# EasyEDA Pro project MAX5864_REUSE.eprj, board PCB4
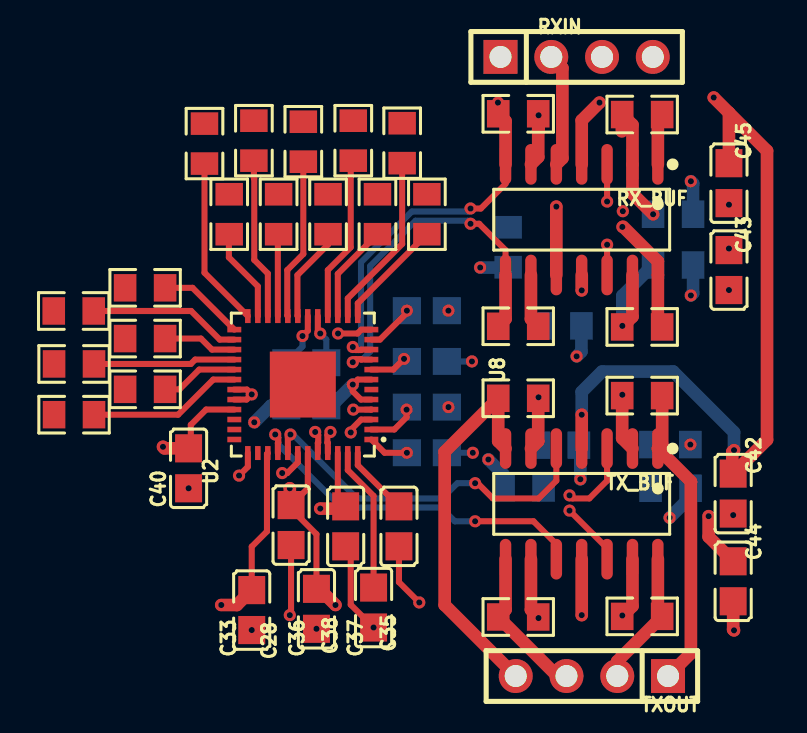
[diagram p10: board, top side]
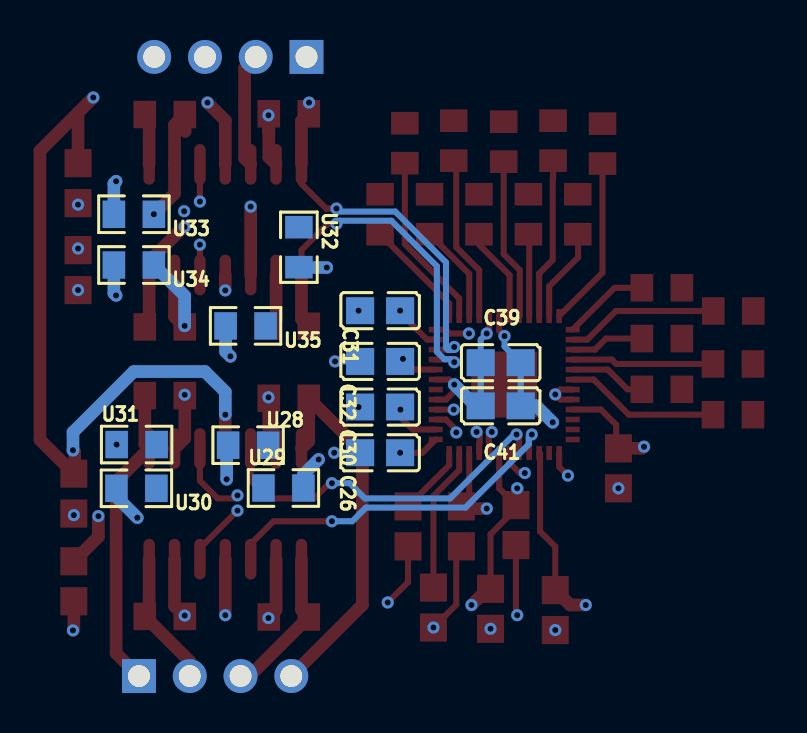
[diagram p11: board, bottom side, seen from below]

No outline. copper layers: Top Layer, GND, inner3, Inner, VCC, Bottom Layer. Coordinates in mm from the lowest, leftmost part position.
Stack: Top Layer 0.035mm 外层铜厚1oz / Dielectric1 0.0994mm 3313 RC57% 4.2mil / GND 0.035mm - / Dielectric2 0.55mm 0.55mm H/H不含铜 / inner3 0.035mm - / Dielectric3 0.1088mm 2116 RC54% 4.9mil / Inner 0.035mm - / Dielectric4 0.55mm 0.55mm H/H不含铜 / VCC 0.0152mm 内层铜厚 / Dielectric5 0.0994mm 3313 RC57% 4.2mil / Bottom Layer 0.035mm 外层铜厚1oz

## Design rules (mm)
net RX_BBCIP: RX_BBCI
net RX_BBCIN: RX_BBCI
net RX_BBCQN: RX_BBCQ
net RX_BBCQP: RX_BBCQ
net BBC_QN: BBC_Q
net BBC_QP: BBC_Q
net BBC_IN: BBC_I
net BBC_IP: BBC_I
template: JLCPCB Capability(Two Layers Board)
spacing copperThickness1oz (default): track to track 0.102, other pairs 0.152 to 0.3
spacing copperThickness2oz: track to track 0.203, other pairs 0.152 to 0.3
track width copperThickness1oz (default): min 0.127, default 0.254, max 2.54
track width copperThickness2oz: min 0.203, default 0.254, max 2.54
differential pair differentialPair (default): width min 0.127, default 0.254, max 2.54; gap min 0.152, default 0.152
via viaSize (default): diameter min 0.5, default 0.61, max 10; hole min 0.3, default 0.305, max 6.3

## Placement (name value [footprint] x y rotation side)
C26  330nF  [C0805]  17.67 11.18 180 bottom
C28  100nF  [C0805]  10.87 7.56 90 top
C30  100nF  [C0805]  17.67 13.46 0 bottom
C31  100nF  [C0805]  17.67 18.29 180 bottom
C32  100nF  [C0805]  17.67 15.75 180 bottom
C33  100nF  [C0805]  8.91 3.3 270 top
C35  330nF  [C0805]  16.27 7.49 270 top
C36  100nF  [C0805]  12.14 3.37 90 top
C37  330nF  [C0805]  15 3.43 90 top
C38  100nF  [C0805]  13.61 7.49 90 top
C39  100nF  [C0805]  11.64 15.68 180 bottom
C40  100nF  [C0805]  5.75 10.4 90 top
C41  100nF  [C0805]  11.64 13.53 180 bottom
C42  330nF  [C0805]  32.99 9.13 90 top
C43  330nF  [C0805]  32.78 20.32 270 top
C44  330nF  [C0805]  32.99 4.74 270 top
C45  330nF  [C0805]  32.78 24.67 90 top
RX_BUF  CLC4601ISO14X  [SOIC-14_L8.7-W3.9-P1.27-LS6.0-BL]  25.42 22.84 180 top
RXIN  -  [HDR-TH_4P-P2.54-V-F]  25.16 30.99 0 top
TX_BUF  CLC4601ISO14X  [SOIC-14_L8.7-W3.9-P1.27-LS6.0-BL]  25.42 8.62 180 top
TXOUT  -  [HDR-TH_4P-P2.54-V-F]  25.92 0 180 top
U2  MAX5864ETM+  [qfn-48_l7.0-w7.0-p0.50-bl-ep5.1]  11.46 14.59 90 top
U3  1120  [R0805]  22.24 2.96 0 top
U4  1120  [R0805]  28.44 28.1 0 top
U5  1120  [R0805]  28.44 17.47 180 top
U6  1120  [R0805]  22.24 17.51 0 top
U7  1120  [R0805]  22.24 28.14 180 top
U8  1120  [R0805]  22.24 13.9 180 top
U9  1120  [R0805]  28.44 14.04 0 top
U10  1120  [R0805]  28.44 2.99 180 top
U11  100  [R0805]  0.02 13.08 0 top
U12  100  [R0805]  3.57 14.35 0 top
U13  100  [R0805]  0.02 15.62 0 top
U14  100  [R0805]  3.57 16.89 0 top
U15  100  [R0805]  0 18.27 0 top
U16  100  [R0805]  3.57 19.43 0 top
U17  100  [R0805]  6.54 26.65 90 top
U18  100  [R0805]  7.78 23.11 90 top
U19  100  [R0805]  9.02 26.8 90 top
U20  100  [R0805]  10.25 23.11 90 top
U21  100  [R0805]  11.49 26.75 90 top
U22  100  [R0805]  12.72 23.11 90 top
U23  100  [R0805]  13.99 26.8 90 top
U24  100  [R0805]  15.2 23.11 90 top
U25  100  [R0805]  16.43 26.67 90 top
U26  100  [R0805]  17.67 23.11 90 top
U28  1120  [R0805]  24.27 11.56 0 bottom
U29  1120  [R0805]  22.51 9.41 180 bottom
U30  1120  [R0805]  29.86 9.4 0 bottom
U31  1120  [R0805]  29.85 11.59 180 bottom
U32  1120  [R0805]  21.73 21.46 270 bottom
U33  1120  [R0805]  29.99 23.11 0 bottom
U34  1120  [R0805]  29.99 20.57 0 bottom
U35  1120  [R0805]  24.4 17.53 0 bottom

## Footprints (pads in the part's own frame, mm; a bottom-side part is the same pattern mirrored in y, then rotated)
C0805
  rect 1.41x1.35 smd: 1(-1,0) 2(1,0)
HDR-TH_4P-P2.54-V-F
  rect 1.7x1.7 hole 1.1: 1(-3.81,0)
  round 1.7 hole 1.1: 2(-1.27,0) 3(1.27,0) 4(3.81,0)
qfn-48_l7.0-w7.0-p0.50-bl-ep5.1
  rect 0.28x0.7 smd: 1(-2.75,-3.428) 2(-2.25,-3.428) 3(-1.75,-3.428) 4(-1.25,-3.428) 5(-0.75,-3.428) 6(-0.25,-3.428) 7(0.25,-3.428) 8(0.75,-3.428) 9(1.25,-3.428) 10(1.75,-3.428) 11(2.25,-3.428) 12(2.75,-3.428) 25(2.75,3.428) 26(2.25,3.428) 27(1.75,3.428) 28(1.25,3.428) 29(0.75,3.428) 30(0.25,3.428) 31(-0.25,3.428) 32(-0.75,3.428) 33(-1.25,3.428) 34(-1.75,3.428) 35(-2.25,3.428) 36(-2.75,3.428)
  rect 0.7x0.28 smd: 13(3.428,-2.75) 14(3.428,-2.25) 15(3.428,-1.75) 16(3.428,-1.25) 17(3.428,-0.75) 18(3.428,-0.25) 19(3.428,0.25) 20(3.428,0.75) 21(3.428,1.25) 22(3.428,1.75) 23(3.428,2.25) 24(3.428,2.75) 37(-3.428,2.75) 38(-3.428,2.25) 39(-3.428,1.75) 40(-3.428,1.25) 41(-3.428,0.75) 42(-3.428,0.25) 43(-3.428,-0.25) 44(-3.428,-0.75) 45(-3.428,-1.25) 46(-3.428,-1.75) 47(-3.428,-2.25) 48(-3.428,-2.75)
  rect 3.302x3.302 smd: 49(0,0)
R0805
  rect 1.133x1.377 smd: 1(-1,0) 2(1,0)
SOIC-14_L8.7-W3.9-P1.27-LS6.0-BL
  oval 0.574x2.038 smd: 1(-3.81,-2.769) 2(-2.54,-2.769) 3(-1.27,-2.769) 4(0,-2.769) 5(1.27,-2.769) 6(2.54,-2.769) 7(3.81,-2.769) 8(3.81,2.769) 9(2.54,2.769) 10(1.27,2.769) 11(0,2.769) 12(-1.27,2.769) 13(-2.54,2.769) 14(-3.81,2.769)

## Nets
+5V: C42.2 C45.2 RX_BUF.4 TX_BUF.4
-5V: C43.2 C44.2 RX_BUF.11 TX_BUF.11
GND: C26.1 C28.1 C30.2 C31.1 C32.1 C33.2 C35.2 C36.1 C37.1 C38.1 C39.1 C40.1 C41.1 C42.1 C43.1 C44.1 C45.1 U2.5 U2.7 U2.12 U2.17 U2.31 U2.32 U2.37 U2.42 U28.2 U29.2 U30.2 U31.1 U32.2 U33.2 U34.2 U35.2
VCC: C28.2 C30.1 C31.2 C32.2 C33.1 C36.2 C38.2 C39.2 C40.2 C41.2 U2.2 U2.8 U2.11 U2.18 U2.33 U2.39 U2.43 U2.46
BBC_CLK: U2.6
BBC_DA0: U26.2
BBC_DA1: U25.2
BBC_DA2: U24.2
BBC_DA3: U23.2
BBC_DA4: U22.2
BBC_DA5: U21.2
BBC_DA6: U20.2
BBC_DA7: U19.2
BBC_DD0: U18.2
BBC_DD1: U17.2
BBC_DD2: U16.1
BBC_DD3: U15.1
BBC_DD4: U14.1
BBC_DD5: U13.1
BBC_DD6: U12.1
BBC_DD7: U11.1
BBC_IN: TX_BUF.12 U2.44
BBC_IP: TX_BUF.3 U2.45
BBC_QN: TX_BUF.10 U2.40
BBC_QP: TX_BUF.5 U2.41
CS: U2.36
DIN: U2.34
RX_BBCIN: RX_BUF.1 U2.4 U4.2
RX_BBCIP: RX_BUF.14 U2.3 U5.1
RX_BBCQN: RX_BUF.8 U2.9 U6.1
RX_BBCQP: RX_BUF.7 U2.10 U7.2
RXIN: RX_BUF.3 RXIN.4
RXIP: RX_BUF.12 RXIN.3
RXQN: RX_BUF.10 RXIN.1
RXQP: RX_BUF.5 RXIN.2
SCLK: U2.35
TXIN: TX_BUF.14 TXOUT.2 U10.1
TXIP: TX_BUF.1 TXOUT.1 U9.2
TXQN: TX_BUF.8 TXOUT.3 U3.1
TXQP: TX_BUF.7 TXOUT.4 U8.2
$1N3982: C37.2 U2.47
$1N8783: RX_BUF.2 U4.1 U33.1
$1N8787: RX_BUF.6 U7.1 U32.1
$1N8791: RX_BUF.9 U6.2 U35.1
$1N8799: RX_BUF.13 U5.2 U34.1
$1N9382: TX_BUF.2 U9.1 U31.2
$1N9385: TX_BUF.6 U8.1 U28.1
$1N9388: TX_BUF.13 U10.2 U30.1
$1N9391: TX_BUF.9 U3.2 U29.1
$1N10591: U2.30 U11.2
$1N10629: U2.29 U12.2
$1N10667: U2.28 U13.2
$1N10705: U2.27 U14.2
$1N10743: U2.26 U15.2
$1N10781: U2.25 U16.2
$1N10830: U2.24 U17.1
$1N10868: U2.23 U18.1
$1N10906: U2.22 U19.1
$1N10944: U2.21 U20.1
$1N10982: U2.20 U21.1
$1N11020: U2.19 U22.1
$1N11058: U2.16 U23.1
$1N11162: U2.15 U24.1
$1N11200: U2.14 U25.1
$1N11238: U2.13 U26.1
$1N11679: C35.1 U2.48
$1N11690: C26.2 U2.1

Pads without a net: U2 38 49

## Via types
v1: diameter 0.61, hole 0.305, Top Layer to Bottom Layer, 74 vias

## Routing (per net, layer and track width the routed paths; a pad name or vN(x,y) marks a point on that pad's centre or on a via; arc(x,y) is an arc through that point)
+5V: length 46.7
  Top Layer w0.635: C42.2 34.69,11.83 34.69,26.29 32.78,28.19 ; C45.2 32.78,28.19 ; 32.78,28.19 v1(32.02,28.96) ; TX_BUF.4 v1(25.42,13.08) ; 32.95,10.13 32.95,11.22 v1(33.04,11.3) ; RX_BUF.4 25.42,27.81 v1(26.31,28.7)
  inner3 w0.635: v1(32.02,28.96) 26.56,28.96 v1(26.31,28.7)
  Bottom Layer w0.635: v1(25.42,13.08) 25.42,14.22 26.43,15.24 30,15.24 33.04,12.2 v1(33.04,11.3)
-5V: length 40.3
  Top Layer w0.635: v1(25.42,19.3) 25.42,20.07 ; C44.2 32.99,2.33 v1(33.04,2.29) ; 25.42,3.05 TX_BUF.11
  inner3 w0.635: v1(25.42,3.05) 25.67,3.05 26.81,1.91 29.23,1.91 29.61,2.29 v1(33.04,2.29) 34.69,3.94 34.69,17.41 v1(32.78,19.32) 31.4,20.7 26.81,20.7 v1(25.42,19.3)
GND: length 43.8
  Top Layer w0.305: U2.7 14.21,14.84 v1(13.96,14.59) 13.96,14.25 14.37,13.84 U2.5 ; v1(17.29,3.68) 16.27,4.7 C35.2 ; v1(15,2.43) 13.86,3.57 13.86,6.24 C38.1 ; 8.03,14.34 8.66,14.34 v1(8.91,14.1) 8.65,13.84 U2.32 ; v1(10.81,3.05) 10.87,3.11 C28.1 ; U2.37 8.71,10.47 v1(8.27,10.03) ; v1(12.34,17.15) 12.21,17.27 U2.17 ; U2.12 14.39,17.34 14.19,17.15 v1(13.22,17.15) ; U2.42 11.21,10.69 10.68,10.16 v1(10.43,10.16)
  Top Layer w0.635: v1(31.77,8) 31.77,6.97 C44.1
  Bottom Layer w0.305: v1(19.97,11.18) C26.1 ; v1(19.92,15.75) C32.1 ; v1(12.34,17.15) 12.64,16.84 C39.1 C41.1
  Bottom Layer w0.635: v1(29.82,7.92) 30.86,8.97 U30.2 ; U34.2 30.99,19.16 v1(30.88,19.05) ; v1(20.34,20.45) 21.72,20.45 U32.2 ; v1(20.75,10.84) 21.51,10.08 U29.2 ; C41.1 12.9,13.53 v1(13.96,14.59) ; U33.2 30.99,24.65 v1(30.88,24.76) ; v1(25.16,16) 25.4,16.24 U35.2 ; v1(25.35,9.85) 25.35,11.48 U28.2
  vias: v1(5.75,9.4) v1(8.91,2.3) v1(12.14,2.37) v1(18.75,18.29) v1(18.75,13.46) v1(30.85,11.59) v1(32.78,23.59) v1(32.78,21.4) v1(32.99,8.05)
VCC: length 41.9
  Top Layer w0.305: v1(16.53,15.88) 15.99,15.34 14.89,15.34 ; C40.2 5.86,11.51 5.86,12.57 6.62,13.34 8.03,13.34 ; C36.2 12.14,7.1 10.87,8.37 C28.2 11.71,9.39 U2.43 ; v1(11.45,17.02) 11.71,17.28 U2.18 ; U2.39 9.67,11.12 9.67,7.24 8.91,6.48 C33.1 ; v1(16.67,18.29) 16.67,18.19 15.32,16.84 U2.11 ; v1(16.65,13.34) 16.65,12.95 16.04,12.34 14.89,12.34 ; 13.46,8.64 13.21,8.89 U2.46
  Top Layer w0.635: v1(13.1,3.56) 12.29,4.37 C36.2 ; C33.1 8.16,3.56 v1(7.38,3.56) ; C40.2 4.54,11.4 v1(4.47,11.48) ; C28.2 10.81,8.62 v1(10.81,9.4) ; v1(12.34,8.38) 13.21,8.38 13.46,8.64 C38.2
  Bottom Layer w0.305: C41.2 C39.2 11.45,16.49 v1(11.45,17.02)
  Bottom Layer w0.635: C41.2 9.86,13.53 v1(9.03,12.7) ; C32.2 16.65,15.75 v1(16.53,15.88) ; C30.1 16.67,13.35 v1(16.65,13.34)
BBC_IN: length 18.9
  Top Layer w0.305: v1(12.08,12.22) 12.23,12.06 12.23,11.69 12.21,11.66 U2.44 ; TX_BUF.12 26.69,6.4 v1(24.81,8.28)
  inner3 w0.305: v1(12.08,12.22) 12.23,12.06 12.23,11.72 15.52,8.43 24.65,8.43 v1(24.81,8.28)
BBC_IP: length 18.8
  Top Layer w0.305: v1(12.84,12.22) 12.69,12.06 12.69,11.69 12.71,11.66 U2.45 ; v1(24.81,9.04) 24.96,8.89 25.8,8.89 26.69,9.78 TX_BUF.3
  inner3 w0.305: v1(12.84,12.22) 12.69,12.06 12.69,11.91 15.71,8.89 24.65,8.89 v1(24.81,9.04)
BBC_QN: length 18.3
  Top Layer w0.305: 24.15,5.85 24.15,6.6 23,7.75 v1(20.08,7.75) ; v1(10.08,12.09) 10.23,11.94 10.23,11.69 10.21,11.66 U2.40
  Bottom Layer w0.305: v1(10.08,12.09) 10.23,11.94 10.23,11.6 13.4,8.43 18.38,8.43 19.07,7.75 v1(20.08,7.75)
BBC_QP: length 18.2
  Top Layer w0.305: U2.41 10.71,11.96 v1(10.84,12.09) ; v1(20.08,9.65) 20.21,9.65 20.97,8.89 23.26,8.89 24.15,9.78 24.15,11.39
  Bottom Layer w0.305: v1(20.08,9.65) 19.19,9.65 18.43,8.89 14.17,8.89 10.97,12.09 v1(10.84,12.09)
RX_BBCIN: length 24.2
  Top Layer w0.305: v1(13.99,13.34) 14.88,13.34 14.89,13.34
  Top Layer w0.635: U4.2 29.23,27.89 RX_BUF.1
  inner3 w0.305: 27.49,23.28 v1(27.47,23.27) 27.32,23.11 24.91,23.11 16.65,14.86 15.81,14.86 14.27,13.32 14,13.32 v1(13.99,13.34)
  inner3 w0.635: RX_BUF.1 29.23,25.02 27.49,23.28
RX_BBCIP: length 25.2
  Top Layer w0.305: 27.49,22.49 27.46,22.49 v1(27.45,22.48) ; v1(13.86,12.19) 13.86,12.32 14.38,12.84 U2.3
  Top Layer w0.635: 27.49,22.49 29.23,20.75 RX_BUF.14 29.23,17.69 U5.1
  inner3 w0.305: v1(13.86,12.19) 14.2,12.19 16.41,14.4 16.84,14.4 25.1,22.66 27.27,22.66 v1(27.45,22.48)
RX_BBCQN: length 18.7
  Top Layer w0.305: v1(19.85,22.64) 20.28,22.64 21.61,21.32 RX_BUF.8 ; v1(13.96,15.71) 14.11,15.86 14.37,15.86 14.39,15.84 U2.9
  Top Layer w0.635: U6.1 21.61,17.87 RX_BUF.8
  Bottom Layer w0.305: v1(19.85,22.64) 19.7,22.79 17.1,22.79 14.83,20.52 14.83,16.24 14.45,15.86 14.11,15.86 v1(13.96,15.71)
RX_BBCQP: length 18.9
  Top Layer w0.305: U7.2 21.23,28.16 v1(21.23,28.7) ; v1(13.96,16.47) 14.11,16.32 14.37,16.32 14.39,16.34 U2.10 ; v1(19.85,23.4) 20.37,23.4 21.61,24.64 RX_BUF.7
  Top Layer w0.635: U7.2 21.61,27.78 RX_BUF.7
  Bottom Layer w0.305: v1(19.85,23.4) 19.7,23.25 16.91,23.25 14.37,20.71 14.37,16.43 14.27,16.32 14.11,16.32 v1(13.96,16.47)
RXIN: length 10
  Top Layer w0.305: 26.69,23.75 RX_BUF.3
  Inner w0.635: RXIN.4 28.97,26.03 v1(26.69,23.75)
RXIP: length 11.8
  Top Layer w0.305: 26.69,21.59 RX_BUF.12
  Inner w0.635: v1(26.69,21.59) 25.43,22.85 25.43,29.99 RXIN.3
RXQN: length 12.1
  Top Layer w0.635: v1(24.15,23.5) 24.15,20.07
  Inner w0.635: v1(24.15,23.5) 22.11,25.53 22.11,30.23 RXIN.1
RXQP: length 5.7
  Top Layer w0.635: RX_BUF.5 24.45,25.92 24.45,30.43 RXIN.2
TXIN: length 6.9
  Top Layer w0.635: TX_BUF.14 29.23,3.2 U10.1 27.19,0.74 TXOUT.2
TXIP: length 15.3
  Top Layer w0.635: U9.2 29.44,11.6 TX_BUF.1 30.88,9.73 30.88,1.14 TXOUT.1
TXQN: length 7.7
  Top Layer w0.635: TX_BUF.8 21.61,3.32 U3.1 24.2,0 TXOUT.3
TXQP: length 19.2
  Top Layer w0.635: TX_BUF.7 21.24,11.75 U8.2 18.56,11.22 18.56,3.56 TXOUT.4
$1N3982: length 7.3
  Top Layer w0.305: C37.2 15,9.02 13.71,10.31 U2.47
$1N8783: length 6.5
  Top Layer w0.635: 27.42,27.26 27.42,28.09 U4.1 27.96,27.59 RX_BUF.2 27.96,24.15 v1(28.99,23.11)
$1N8787: length 10.6
  Top Layer w0.635: 23.24,27.26 U7.1 23.29,28.1 23.26,27.57 ; 23.24,27.26 23.24,25.98 RX_BUF.6 ; 23.24,27.26 23.26,27.57 ; 23.24,27.26 23.26,27.28 23.26,27.57 ; v1(23.26,28.07) 23.26,27.57
  Inner w0.635: U32.1 23.26,23.99 v1(23.26,28.07)
$1N8791: length 3
  Top Layer w0.635: 23.29,17.75 23.24,17.71 U6.2 22.88,17.87 RX_BUF.9
$1N8799: length 6.6
  Top Layer w0.635: v1(27.45,17.53) 27.44,17.52 U5.2 27.96,17.99 RX_BUF.13
  Bottom Layer w0.635: v1(27.45,17.53) 27.45,19.03 U34.1
$1N9382: length 2.9
  Top Layer w0.635: v1(27.45,14.08) 27.44,14.07 U9.1 27.44,11.9 TX_BUF.2
$1N9385: length 2.7
  Top Layer w0.635: v1(23.26,13.95) 23.26,13.92 U8.1 23.24,11.75 TX_BUF.6
$1N9388: length 10.1
  Top Layer w0.635: v1(27.45,3.03) 27.44,3.03 U10.2 27.96,3.5 TX_BUF.13
  Inner w0.635: U30.1 28.86,4.44 v1(27.45,3.03)
$1N9391: length 9.7
  Top Layer w0.635: v1(23.26,2.9) 23.24,2.92 U3.2 22.88,3.32 TX_BUF.9
  Inner w0.635: U29.1 23.51,3.15 v1(23.26,2.9)
$1N10591: length 7.7
  Top Layer w0.305: U11.2 5.22,13.08 6.98,14.84 U2.30
$1N10629: length 3.9
  Top Layer w0.305: 8.03,15.34 6.28,15.34 5.29,14.35 U12.2
$1N10667: length 7.1
  Top Layer w0.305: U13.2 5.86,15.62 6.08,15.84 U2.28
$1N10705: length 3.7
  Top Layer w0.305: U14.2 6.37,16.89 6.92,16.34 U2.27
$1N10743: length 7.6
  Top Layer w0.305: U2.26 7.31,16.84 5.87,18.27 U15.2
$1N10781: length 4.3
  Top Layer w0.305: U16.2 5.94,19.43 U2.25
$1N10830: length 8.5
  Top Layer w0.305: U2.24 6.54,20.19 U17.1
$1N10868: length 4.7
  Top Layer w0.305: U2.23 9.21,19.51 7.76,20.95 7.76,22.1 U18.1
$1N10906: length 8.1
  Top Layer w0.305: U19.1 9.02,24.91 9.03,24.89 9.03,20.83 9.71,20.15 U2.22
$1N10944: length 4.1
  Top Layer w0.305: U2.21 10.21,22.07 U20.1
$1N10982: length 8.1
  Top Layer w0.305: U21.1 11.49,21.12 10.68,20.32 10.68,18.04 U2.20
$1N11020: length 4.7
  Top Layer w0.305: U22.1 12.72,21.6 11.19,20.07 11.19,18.04 U2.19
$1N11058: length 8.2
  Top Layer w0.305: U2.16 12.71,20.32 13.86,21.46 13.86,25.64 13.96,25.75
$1N11162: length 4.9
  Top Layer w0.305: U2.15 13.21,20.13 U24.1
$1N11200: length 8.8
  Top Layer w0.305: U2.14 13.71,18.9 16.43,21.62 U25.1
$1N11238: length 5.5
  Top Layer w0.305: U26.1 14.21,18.66 U2.13
$1N11679: length 3.5
  Top Layer w0.305: C35.1 14.21,10.55 U2.48
$1N11690: length 2.1
  Top Layer w0.305: U2.1 15.55,11.18 v1(16.67,11.18)
